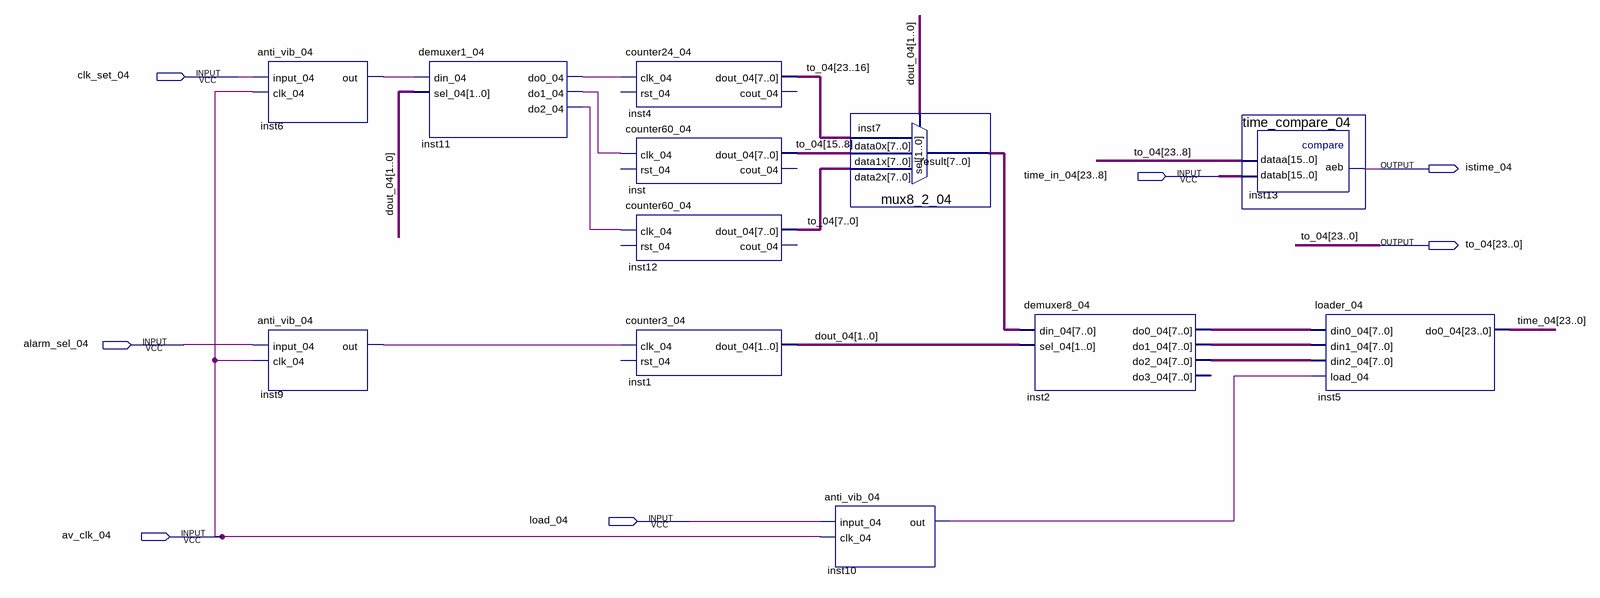
[diagram p0: schematic sheet]
// Quartus schematic alarm_04.bdf as structural Verilog: 12 symbols, 7 pins
module alarm_04 (
  input  clk_set_04,
  input  [23:8] time_in_04,
  input  alarm_sel_04,
  input  load_04,
  input  av_clk_04,
  output istime_04,
  output [23:0] to_04
);

  wire inst6_out, inst9_out, inst10_out, inst11_do0_04, inst11_do1_04, inst11_do2_04;
  wire [1:0] dout_04;
  wire [7:0] inst2_do0_04, inst2_do1_04, inst2_do2_04, inst7_result;
  wire [23:0] time_04;

  anti_vib_04 inst6 (.input_04(clk_set_04), .clk_04(av_clk_04), .out(inst6_out));
  anti_vib_04 inst9 (.input_04(alarm_sel_04), .clk_04(av_clk_04), .out(inst9_out));
  demuxer1_04 inst11 (
    .din_04(inst6_out), .sel_04(dout_04), .do0_04(inst11_do0_04), .do1_04(inst11_do1_04),
    .do2_04(inst11_do2_04));
  counter24_04 inst4 (.clk_04(inst11_do0_04), .dout_04(to_04[23:16]));  // open: rst_04, cout_04
  counter60_04 inst (.clk_04(inst11_do1_04), .dout_04(to_04[15:8]));  // open: rst_04, cout_04
  counter60_04 inst12 (.clk_04(inst11_do2_04), .dout_04(to_04[7:0]));  // open: rst_04, cout_04
  counter3_04 inst1 (.clk_04(inst9_out), .dout_04(dout_04));  // open: rst_04
  mux8_2_04 inst7 (
    .data2x(to_04[7:0]), .data1x(to_04[15:8]), .data0x(to_04[23:16]), .sel(dout_04), .result(inst7_result));
  anti_vib_04 inst10 (.input_04(load_04), .clk_04(av_clk_04), .out(inst10_out));
  demuxer8_04 inst2 (
    .din_04(inst7_result), .sel_04(dout_04), .do0_04(inst2_do0_04), .do1_04(inst2_do1_04),
    .do2_04(inst2_do2_04));  // open: do3_04
  time_compare_04 inst13 (.dataa(to_04[23:8]), .datab(time_in_04), .aeb(istime_04));
  loader_04 inst5 (
    .din0_04(inst2_do0_04), .din1_04(inst2_do1_04), .din2_04(inst2_do2_04), .load_04(inst10_out),
    .do0_04(time_04));
endmodule
